# EasyEDA Pro project USB Hub Switch.eprj, board Smart Switch PCB
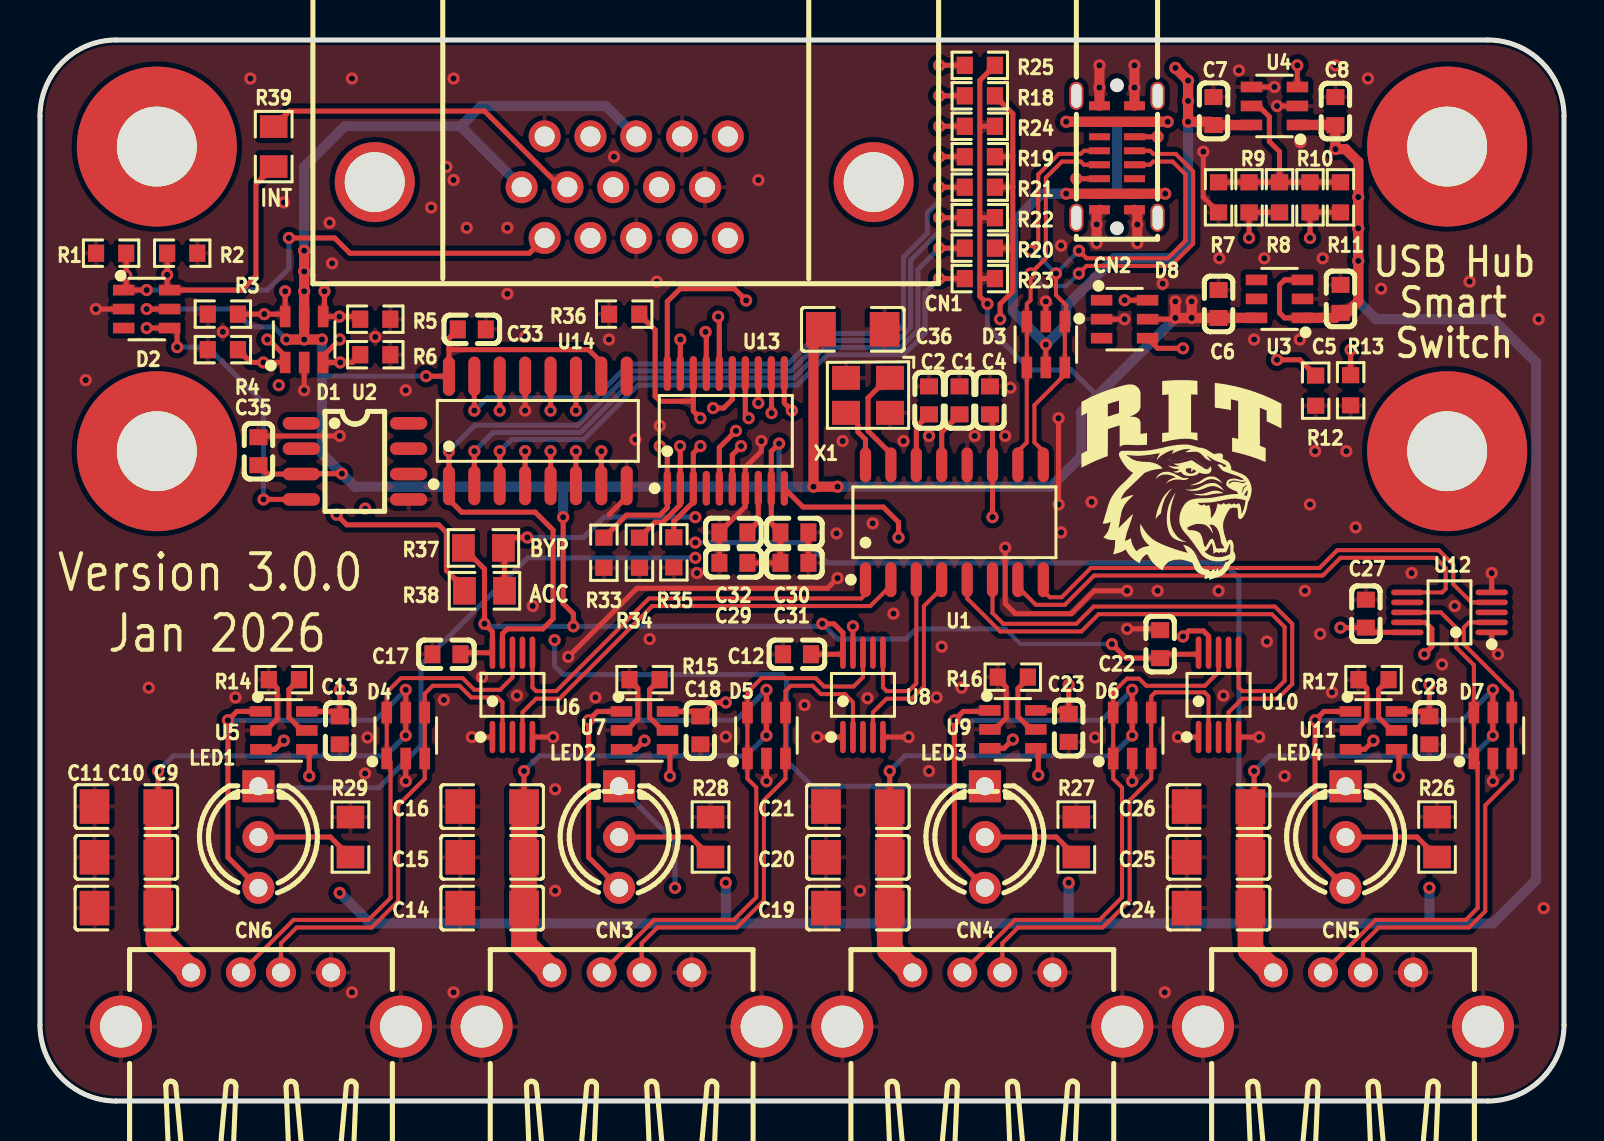
[diagram p4: board, top side]
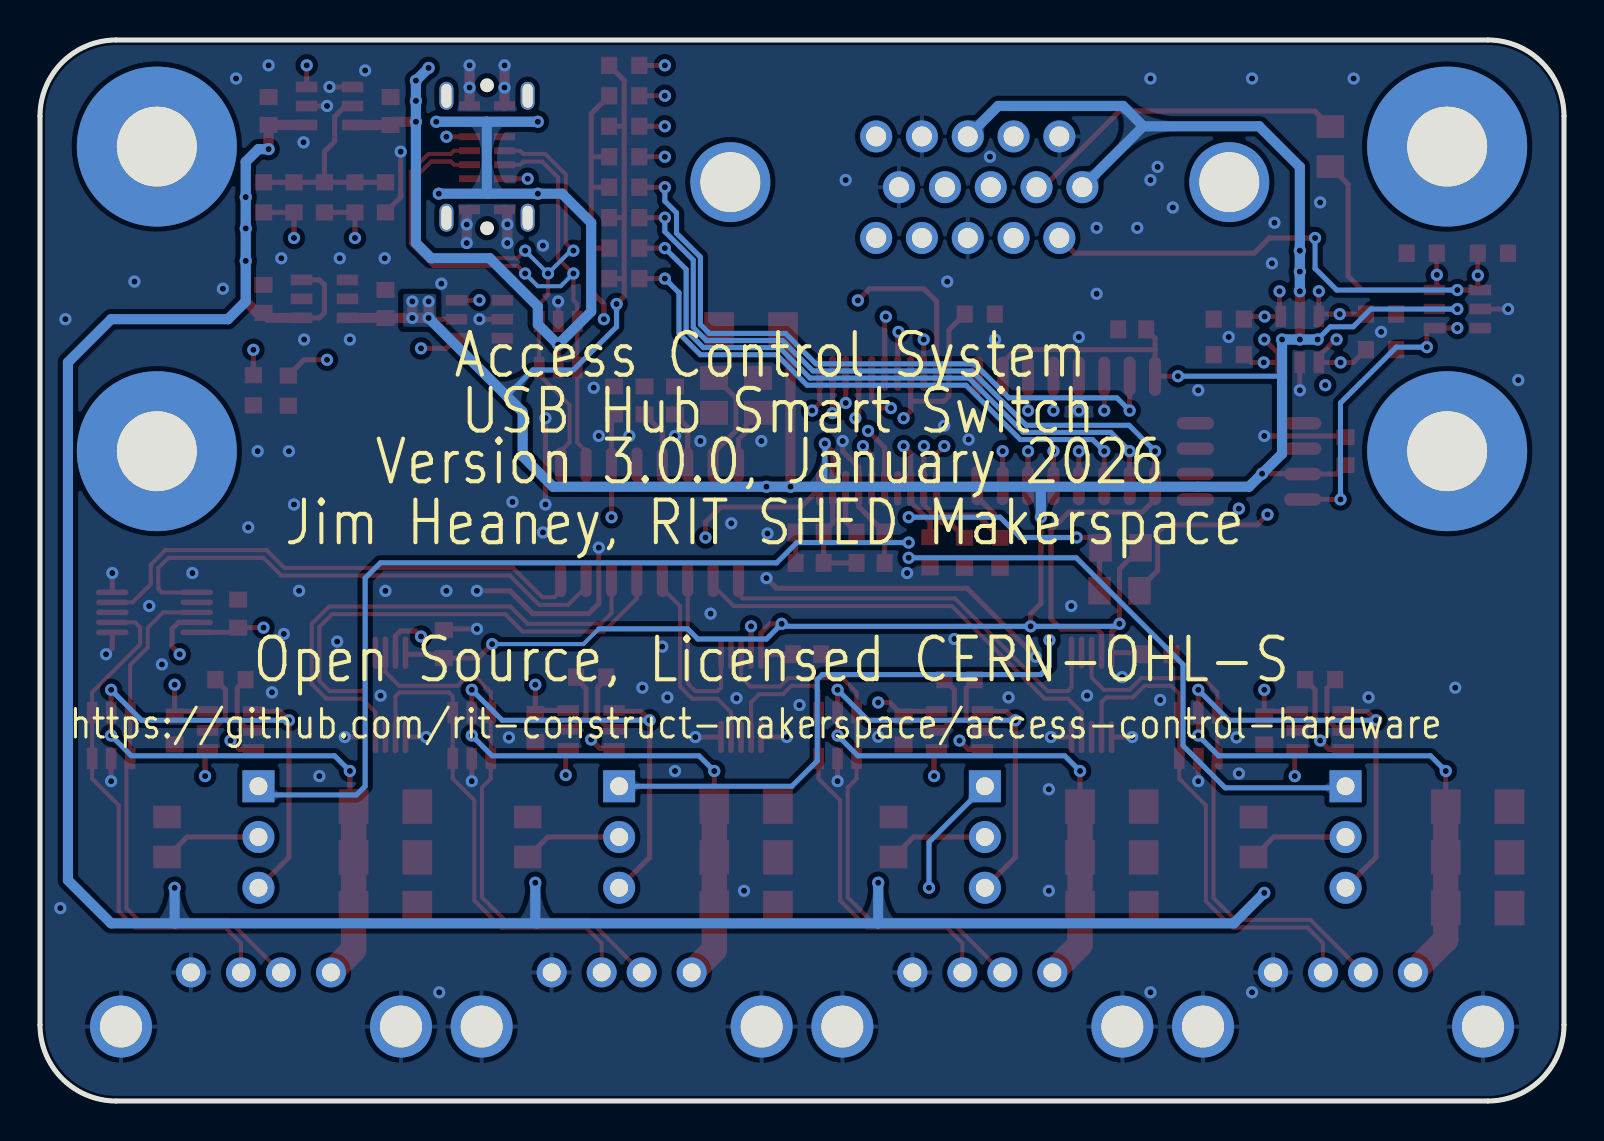
[diagram p5: board, bottom side, seen from below]

Outline 76.2 x 53.09 mm; copper layers: Top Layer, Inner1, Inner2, Bottom Layer. Coordinates in mm from the lower left corner of the outline.
Outline path: 0,49.28 0,3.81 arc(1.12,1.12) 3.81,0 72.39,0 arc(75.08,1.12) 76.2,3.81 76.2,49.28 arc(75.08,51.97) 72.39,53.09 3.81,53.09 arc(1.12,51.97) 0,49.28
Stack: Top Layer 0.035mm Outer layer thickness 1oz / Dielectric1 0.2104mm 7628 RC49% 8.6mil / Inner1 0.0152mm Inner layer thickness / Dielectric2 1.065mm 1.1mm H/HOZ Copper / Inner2 0.0152mm Inner layer thickness / Dielectric3 0.2104mm 7628 RC49% 8.6mil / Bottom Layer 0.035mm Outer layer thickness 1oz

## Design rules (mm)
net D-: DP5
net D+: DP5
net D-1: DP1
net D+1: DP1
net D-2: DP2
net D+2: DP2
net D-3: DP3
net D+3: DP3
net D-4: DP4
net D+4: DP4
net D-HUB4: DP9
net D+HUB4: DP9
net D-HUB3: DP8
net D+HUB3: DP8
net D-HUB2: DP7
net D+HUB2: DP7
net D-HUB1: DP6
net D+HUB1: DP6
template: Custom Config
spacing copperThickness1oz (default): track to track 0.102, other pairs 0.152 to 0.3
spacing copperThickness2oz: track to track 0.203, other pairs 0.152 to 0.3
track width copperThickness1oz (default): min 0.127, default 0.254, max 2.54
track width copperThickness2oz: min 0.203, default 0.254, max 2.54
differential pair USB Coplanar (default): width min 0.203, default 0.203, max 0.203; gap min 0.127, default 0.127
via viaSize (default): diameter min 0.5, default 0.61, max 10; hole min 0.3, default 0.305, max 6.3

## Placement (name value [footprint] x y rotation side)
C1  10uF  [C0603]  45.97 35.05 270 top
C2  10uF  [C0603]  44.45 35.05 270 top
C4  10uF  [C0603]  47.5 35.05 270 top
C5  1uF  [C0603]  65.02 40.13 270 top
C6  10uF  [C0603]  58.93 39.88 270 top
C7  10uF  [C0603]  58.67 49.53 270 top
C8  10uF  [C0603]  64.77 49.53 90 top
C9  47uF  [C1206]  4.32 9.65 180 top
C10  47uF  [C1206]  4.32 12.19 180 top
C11  47uF  [C1206]  4.32 14.73 180 top
C12  100nF  [C0603]  37.85 22.35 0 top
C13  10uF  [C0603]  14.99 18.54 90 top
C14  47uF  [C1206]  22.61 9.65 180 top
C15  47uF  [C1206]  22.61 12.19 180 top
C16  47uF  [C1206]  22.61 14.73 180 top
C17  100nF  [C0603]  20.32 22.35 0 top
C18  10uF  [C0603]  33.02 18.54 90 top
C19  47uF  [C1206]  40.89 9.65 180 top
C20  47uF  [C1206]  40.89 12.19 180 top
C21  47uF  [C1206]  40.89 14.73 180 top
C22  100nF  [C0603]  56.01 22.86 270 top
C23  10uF  [C0603]  51.43 18.67 90 top
C24  47uF  [C1206]  58.93 9.65 180 top
C25  47uF  [C1206]  58.93 12.19 180 top
C26  47uF  [C1206]  58.93 14.73 180 top
C27  100nF  [C0603]  66.29 24.38 270 top
C28  10uF  [C0603]  69.47 18.54 90 top
C29  10uF  [C0603]  34.67 26.92 180 top
C30  1uF  [C0603]  37.72 26.92 180 top
C31  100nF  [C0603]  37.72 28.45 180 top
C32  1uF  [C0603]  34.67 28.45 0 top
C33  100nF  [C0603]  21.59 38.61 180 top
C35  100nF  [C0603]  10.92 32.51 270 top
C36  47uF  [C1206]  40.64 38.61 180 top
CN1  DS1038-15FBNSiA74-0CC  [DSUB-TH_DS1038-15FBNSIA74-0CC]  29.21 45.72 180 top
CN2  HC-TYPE-C-16P-067A  [USB-SMD_HC-TYPE-C-16P-FLS7.2-5A-11]  53.85 47.24 0 top
CN3  902-131A1011D10100  [USB-A-TH__USB-AF-90]  29.08 5.08 0 top
CN4  902-131A1011D10100  [USB-A-TH__USB-AF-90]  47.12 5.08 0 top
CN5  902-131A1011D10100  [USB-A-TH__USB-AF-90]  65.15 5.08 0 top
CN6  902-131A1011D10100  [USB-A-TH__USB-AF-90]  11.05 5.08 0 top
D1  SRV05-4  [SOT-23-6_L2.9-W1.6-P0.95-LS2.8-BL]  13.21 38.1 0 top
D2  SRV05-4  [SOT-23-6_L2.9-W1.6-P0.95-LS2.8-BL]  5.33 39.62 270 top
D3  SRV05-4  [SOT-23-6_L2.9-W1.6-P0.95-LS2.8-BL]  50.29 37.85 180 top
D4  SRV05-4  [SOT-23-6_L2.9-W1.6-P0.95-LS2.8-BL]  18.29 18.29 0 top
D5  SRV05-4  [SOT-23-6_L2.9-W1.6-P0.95-LS2.8-BL]  36.32 18.29 0 top
D6  SRV05-4  [SOT-23-6_L2.9-W1.6-P0.95-LS2.8-BL]  54.61 18.29 0 top
D7  SRV05-4  [SOT-23-6_L2.9-W1.6-P0.95-LS2.8-BL]  72.64 18.29 0 top
D8  SRV05-4  [SOT-23-6_L2.9-W1.6-P0.95-LS2.8-BL]  54.23 39.12 270 top
LED1  TZ-LAMP05RB4HD-C  [LED-TH_3P-BD5.8-P2.54-R-BI]  10.92 13.21 90 top
LED2  TZ-LAMP05RB4HD-C  [LED-TH_3P-BD5.8-P2.54-R-BI]  28.96 13.21 90 top
LED3  TZ-LAMP05RB4HD-C  [LED-TH_3P-BD5.8-P2.54-R-BI]  47.24 13.21 90 top
LED4  TZ-LAMP05RB4HD-C  [LED-TH_3P-BD5.8-P2.54-R-BI]  65.28 13.21 90 top
NOREF  -  [Pad_e1726]  5.84 47.75 0 top
NOREF#2  -  [Pad_e1666]  70.36 32.51 0 top
NOREF#3  -  [Pad_e1727]  70.36 47.75 0 top
NOREF#4  -  [Pad_e1686]  5.84 32.51 0 top
R1  10kΩ  [R0603]  3.56 42.42 180 top
R2  120kΩ  [R0603]  7.11 42.42 180 top
R3  10kΩ  [R0603]  9.14 39.37 0 top
R4  10kΩ  [R0603]  9.14 37.59 0 top
R5  10kΩ  [R0603]  16.76 39.12 180 top
R6  10kΩ  [R0603]  16.76 37.34 180 top
R7  120kΩ  [R0603]  58.93 45.21 90 top
R8  120kΩ  [R0603]  61.98 45.21 90 top
R9  120kΩ  [R0603]  60.45 45.21 90 top
R10  120kΩ  [R0603]  63.5 45.21 90 top
R11  120kΩ  [R0603]  65.02 45.21 90 top
R12  5.1kΩ  [R0603]  63.78 35.54 90 top
R13  5.1kΩ  [R0603]  65.53 35.56 90 top
R14  120kΩ  [R0603]  12.19 21.08 0 top
R15  120kΩ  [R0603]  30.23 21.08 0 top
R16  120kΩ  [R0603]  48.64 21.21 0 top
R17  120kΩ  [R0603]  66.67 21.08 0 top
R18  10kΩ  [R0603]  46.99 50.29 180 top
R19  10kΩ  [R0603]  46.99 47.24 180 top
R20  10kΩ  [R0603]  46.99 42.67 180 top
R21  10kΩ  [R0603]  46.99 45.72 180 top
R22  10kΩ  [R0603]  46.99 44.2 180 top
R23  10kΩ  [R0603]  46.99 41.15 180 top
R24  10kΩ  [R0603]  46.99 48.77 180 top
R25  10kΩ  [R0603]  46.99 51.82 180 top
R26  1kΩ  [R0805]  69.85 13.21 270 top
R27  1kΩ  [R0805]  51.82 13.21 270 top
R28  1kΩ  [R0805]  33.53 13.21 270 top
R29  1kΩ  [R0805]  15.52 13.21 270 top
R33  10kΩ  [R0603]  28.19 27.43 270 top
R34  10kΩ  [R0603]  29.97 27.43 270 top
R35  10kΩ  [R0603]  31.69 27.45 270 top
R36  10kΩ  [R0603]  29.21 39.37 180 top
R37  0Ω  [R0805]  22.17 27.67 0 top
R38  0Ω  [R0805]  22.23 25.53 0 top
R39  0Ω  [R0805]  11.68 47.75 90 top
U1  SL2.1A  [SOP-16_L10.0-W3.9-P1.27-LS6.0-BL]  45.72 28.96 0 top
U2  DS18B20Z  [SOP-8_L4.9-W3.9-P1.27-LS6.0-BL]  15.75 32 270 top
U3  MX66100T  [SOT-23-6_L2.9-W1.6-P0.95-LS2.9-BL]  61.98 40.13 90 top
U4  CH217K  [SOT-23-6_L2.9-W1.6-P0.95-LS2.8-BL]  61.72 49.78 90 top
U5  CH217K  [SOT-23-6_L2.9-W1.6-P0.95-LS2.8-BL]  12.19 18.54 270 top
U6  DIO32220MP10  [MSOP-10_L3.0-W3.0-P0.50-LS5.0-BL]  23.62 20.32 0 top
U7  CH217K  [SOT-23-6_L2.9-W1.6-P0.95-LS2.8-BL]  30.23 18.54 270 top
U8  DIO32220MP10  [MSOP-10_L3.0-W3.0-P0.50-LS5.0-BL]  41.15 20.32 0 top
U9  CH217K  [SOT-23-6_L2.9-W1.6-P0.95-LS2.8-BL]  48.64 18.59 270 top
U10  DIO32220MP10  [MSOP-10_L3.0-W3.0-P0.50-LS5.0-BL]  58.93 20.32 0 top
U11  CH217K  [SOT-23-6_L2.9-W1.6-P0.95-LS2.8-BL]  66.67 18.54 270 top
U12  DIO32220MP10  [MSOP-10_L3.0-W3.0-P0.50-LS5.0-BL]  70.47 24.45 90 top
U13  STM8S003F3P6TR  [TSSOP-20_L6.5-W4.4-P0.65-LS6.4-BL]  34.29 33.53 0 top
U14  74HC595D,118  [SOIC-16_L9.9-W3.9-P1.27-LS6.0-BL]  24.89 33.53 0 top
X1  12MHz  [OSC-SMD_4P-L3.2-W2.5-BL]  41.4 35.31 180 top

## Footprints (pads in the part's own frame, mm; a bottom-side part is the same pattern mirrored in y, then rotated)
C0603
  rect 0.8x0.9 smd: 1(-0.7,0) 2(0.7,0)
C1206
  rect 1.485x1.728 smd: 1(-1.593,0) 2(1.593,0)
DSUB-TH_DS1038-15FBNSIA74-0CC
  round 1.6 hole 1: 1(3.978,2.54) 2(1.688,2.54) 3(-0.603,2.54) 4(-2.893,2.54) 5(-5.182,2.54) 6(5.128,0) 7(2.837,0) 8(0.548,0) 9(-1.743,0) 10(-4.042,0) 11(3.978,-2.54) 12(1.688,-2.54) 13(-0.603,-2.54) 14(-2.893,-2.54) 15(-5.182,-2.54)
  round 4 hole 3: 16(12.473,-0.254) 17(-12.473,-0.254)
LED-TH_3P-BD5.8-P2.54-R-BI
  rect 1.6x1.6 hole 0.9: 1(2.54,0)
  round 1.6 hole 0.9: 2(0,0) 3(-2.54,0)
MSOP-10_L3.0-W3.0-P0.50-LS5.0-BL
  oval 0.28x1.62 smd: 1(-1,-2.11) 2(-0.5,-2.11) 3(0,-2.11) 4(0.5,-2.11) 5(1,-2.11) 6(1,2.11) 7(0.5,2.11) 8(0,2.11) 9(-0.5,2.11) 10(-1,2.11)
OSC-SMD_4P-L3.2-W2.5-BL
  rect 1.4x1.2 smd: 1(-1.1,-0.875) 2(1.1,-0.875) 3(1.1,0.875) 4(-1.1,0.875)
Pad_e1666
  round 8 hole 4: 1(0,0)
Pad_e1686
  round 8 hole 4: 1(0,0)
Pad_e1726
  round 8 hole 4: 1(0,0)
Pad_e1727
  round 8 hole 4: 1(0,0)
R0603
  rect 0.806x0.864 smd: 1(-0.753,0) 2(0.753,0)
R0805
  rect 1.133x1.377 smd: 1(-1,0) 2(1,0)
SOIC-16_L9.9-W3.9-P1.27-LS6.0-BL
  oval 0.602x1.971 smd: 1(-4.445,-2.736) 2(-3.175,-2.736) 3(-1.905,-2.736) 4(-0.635,-2.736) 5(0.635,-2.736) 6(1.905,-2.736) 7(3.175,-2.736) 8(4.445,-2.736) 9(4.445,2.736) 10(3.175,2.736) 11(1.905,2.736) 12(0.635,2.736) 13(-0.635,2.736) 14(-1.905,2.736) 15(-3.175,2.736) 16(-4.445,2.736)
SOP-8_L4.9-W3.9-P1.27-LS6.0-BL
  oval 0.63x1.865 smd: 1(-1.905,-2.683) 2(-0.635,-2.683) 3(0.635,-2.683) 4(1.905,-2.683) 5(1.905,2.683) 6(0.635,2.683) 7(-0.635,2.683) 8(-1.905,2.683)
SOP-16_L10.0-W3.9-P1.27-LS6.0-BL
  oval 0.56x1.745 smd: 1(-4.445,-2.873) 2(-3.175,-2.873) 3(-1.905,-2.873) 4(-0.635,-2.873) 5(0.635,-2.873) 6(1.905,-2.873) 7(3.175,-2.873) 8(4.445,-2.873) 9(4.445,2.873) 10(3.175,2.873) 11(1.905,2.873) 12(0.635,2.873) 13(-0.635,2.873) 14(-1.905,2.873) 15(-3.175,2.873) 16(-4.445,2.873)
SOT-23-6_L2.9-W1.6-P0.95-LS2.8-BL
  rect 0.532x1.072 smd: 1(-0.95,-1.149) 2(0,-1.149) 3(0.95,-1.149) 4(0.95,1.149) 5(0,1.149) 6(-0.95,1.149)
SOT-23-6_L2.9-W1.6-P0.95-LS2.9-BL
  rect 0.532x1.072 smd: 1(-0.95,-1.149) 2(0,-1.149) 3(0.95,-1.149) 4(0.95,1.149) 5(0,1.149) 6(-0.95,1.149)
TSSOP-20_L6.5-W4.4-P0.65-LS6.4-BL
  oval 0.364x1.742 smd: 1(-2.925,-2.871) 2(-2.275,-2.871) 3(-1.625,-2.871) 4(-0.975,-2.871) 5(-0.325,-2.871) 6(0.325,-2.871) 7(0.975,-2.871) 8(1.625,-2.871) 9(2.275,-2.871) 10(2.925,-2.871) 11(2.925,2.871) 12(2.275,2.871) 13(1.625,2.871) 14(0.975,2.871) 15(0.325,2.871) 16(-0.325,2.871) 17(-0.975,2.871) 18(-1.625,2.871) 19(-2.275,2.871) 20(-2.925,2.871)
USB-A-TH__USB-AF-90
  round 1.5 hole 0.9: 1(-3.5,1.355) 2(-1,1.355) 3(1,1.355) 4(3.5,1.355)
  round 3.1 hole 2.1: SH1(7,-1.355) SH2(-7,-1.355)
USB-SMD_HC-TYPE-C-16P-FLS7.2-5A-11
  oval 0.7x1.4 hole 0.5x1.2: 0(-2.03,3.05) 0(-2.03,-3.05) 0(2.03,3.05) 0(2.03,-3.05)
  rect 1.05x0.45 smd: A1(-0.875,-2.65) A4(-0.875,-1.85) A9(-0.875,1.75) A12(-0.875,2.55) B1(0.875,2.55) B4(0.875,1.75) B9(0.875,-1.85) B12(0.875,-2.65)
  rect 1.05x0.35 smd: A5(-0.875,-1.1) A6(-0.875,-0.4) A7(-0.875,0.3) A8(-0.875,1) B5(0.875,1) B6(0.875,0.3) B7(0.875,-0.4) B8(0.875,-1.1)

## Nets
As in the schematic.

Pads without a net: CN1 4 5 16 17; CN2 0 A8 B8; D2 3; D8 1 3; NOREF 1; NOREF#2 1; NOREF#3 1; NOREF#4 1; U2 1 2 6 7 8; U3 4 5; U6 3 7; U8 3 7; U10 3 7; U12 3 7; U13 4; U14 9

## Via types
v1: diameter 0.61, hole 0.305, Top Layer to Bottom Layer, 272 vias

## Routing (per net, layer and track width the routed paths; a pad name or vN(x,y) marks a point on that pad's centre or on a via; arc(x,y) is an arc through that point)
+5V: length 242.4
  Top Layer w0.254: v1(19.3,36.26) 20.45,36.26 20.45,37.59 ; 46.99,41.17 47.01,41.15 R23.1 ; 46.99,41.17 46.99,44.18 ; 46.99,41.17 46.99,40.26 v1(47.37,39.88) ; 46.99,48.78 46.99,51.06 R25.1 ; 46.99,48.78 46.99,44.18 ; 46.99,48.78 47,48.77 R24.1 ; D8.5 56.71,39.12 v1(56.77,39.18) ; D2.5 v1(5.33,39.62) ; 46.99,44.18 47,44.2 R22.1 ; C33.2 20.45,38.17 20.45,37.59 ; U12.10 66.53,23.45 C27.2 v1(65.02,23.68) ; 20.45,37.59 27.43,37.59 28.07,36.96 28.07,36.26 ; C12.2 40.07,22.35 U8.10 40.15,23.42 39.7,23.88 v1(39.12,23.88) ; C22.2 54.29,22.16 v1(53.59,22.86) ; 56.33,22.35 57.85,22.35 U10.10 ; C35.2 11.36,31.37 U2.3 13.08,31.39 v1(15.1,31.39) ; C17.2 21.1,22.43 U6.10 22.62,23.48 v1(22.23,23.88) 22.23,26.62 R37.1 ; v1(26.16,29.21) 26.16,24.9 26.15,24.89 26.67,24.38 v1(26.67,23.75) ; v1(36.96,32.89) 36.57,32.5 U13.9 36.57,28.9 37.02,28.45 37.02,26.92 C29.1
  Top Layer w0.508: v1(13.21,38.1) v1(12.32,38.1) ; v1(13.21,38.1) D1.5 v1(13.21,40.51) v1(13.21,41.5) v1(13.21,42.55) ; v1(13.21,38.1) v1(14.1,38.1) ; 38.79,39.12 38.67,39 v1(38.67,30.73) v1(39.88,30.73) ; v1(56.77,40.01) v1(56.77,39.18) v1(57.58,39.18) ; 59.18,39.18 U3.6 ; v1(57.58,39.18) v1(57.58,40.01) ; v1(57.58,39.18) C6.2
  Inner2 w0.254: v1(65.02,23.68) 65.02,22.86 64.26,22.1 54.36,22.1 v1(53.59,22.86)
  Bottom Layer w0.203: v1(53.59,22.86) 49.03,22.86 48.26,23.62
  Bottom Layer w0.254: 36.98,30.73 36.96,30.75 v1(36.96,32.89) ; v1(47.37,39.88) 47.37,38.74 49.53,36.58 51.56,36.58 52.86,35.27 ; 48.26,23.62 43.82,23.62 43.31,23.11 39.88,23.11 v1(39.12,23.88) 38.99,23.75 v1(26.67,23.75) 22.35,23.75 v1(22.23,23.88) ; 14.1,36.21 14.15,36.26 v1(19.3,36.26) ; v1(5.33,39.62) 9.65,39.62 10.54,38.74 11.68,38.74 v1(12.32,38.1) ; 18.29,30.73 18.3,30.73
  Bottom Layer w0.508: v1(13.21,40.51) v1(13.21,41.5) v1(13.21,42.55) 13.21,46.74 15.24,48.77 21.03,48.77 ; 21.03,48.77 22.05,49.78 28.29,49.78 CN1.13 ; 21.03,48.77 CN1.6 ; v1(56.77,39.18) 52.07,34.48 52.07,32.26 50.55,30.73 v1(39.88,30.73) v1(38.67,30.73) 26.16,30.73 ; 26.16,30.73 15.75,30.73 v1(15.1,31.39) 14.1,32.39 v1(14.1,38.1) v1(13.21,38.1) v1(12.32,38.1) ; 26.16,30.73 v1(26.16,29.21)
GND: length 90.5
  Top Layer w0.254: D3.2 v1(50.29,40.01) ; 65.77,18.54 66.34,19.11 66.34,20.65 65.91,21.08 ; C22.1 55.95,23.62 v1(54.36,23.62) ; U6.5 v1(25.65,18.21) ; U4.4 v1(61.72,50.73) ; U14.8 29.34,30.23 28.45,29.34 ; v1(58.17,47.5) 58.17,45.22 R7.1 ; 47.74,18.59 48.31,19.16 48.31,20.71 47.88,21.13 ; U4.2 v1(61.85,49.78) ; D7.2 v1(72.64,16) ; D6.2 v1(54.61,16) ; C31.1 C30.1 ; v1(54.36,25.53) 52.7,25.53 51.56,24.38 48.77,24.38 48.26,24.89 v1(48.26,27.69) ; 29.32,18.54 29.89,19.11 29.89,20.65 29.46,21.08 ; 33.97,26.92 33.97,28.45 35.27,29.74 U13.7 35.27,31.71 36.07,32.51 v1(36.07,33.02) ; D8.2 v1(54.23,39.12) ; v1(26.42,22.23) 29.85,25.65 39.37,25.65 v1(39.88,26.16) ; D4.2 v1(18.29,16) ; v1(50.93,34.16) v1(50.93,29.85) ; D2.2 v1(2.79,39.62) ; U10.5 v1(60.96,18.21) ; U12.1 72.58,22.67 v1(72.9,22.35) ; U14.13 v1(24.26,34.54) ; 11.18,21.08 11.43,21.08 11.86,20.65 11.86,19.11 11.29,18.54 U5.2 ; U6.1 v1(21.59,18.21) ; U12.5 v1(72.58,26.42) ; U8.5 v1(43.43,18.21) ; U10.1 v1(56.9,18.21) ; D5.2 v1(36.32,16) ; U8.1 v1(38.86,18.21) ; v1(14.99,33.27) 10.98,33.27 C35.1 ; D1.2 v1(13.21,35.56)
  Top Layer w0.508: CN2.A12 v1(52.97,50.71) v1(52.97,51.82) ; v1(54.86,42.93) v1(54.86,43.85) 54.86,44.45 CN2.B12 ; CN2.A1 52.83,44.45 v1(52.83,43.86) v1(52.83,42.93) ; v1(54.72,51.82) v1(54.72,50.71) CN2.B1
  vias: v1(2.29,36.07) v1(5.44,20.68) v1(9.14,38.48) v1(9.77,20.19) v1(10.52,51.16) v1(12.19,44.96) v1(14.48,43.94) v1(14.61,41.91) v1(15.6,51.16) v1(15.6,5.44) v1(16.26,16.38) v1(16.38,18.19) v1(16.76,38.23) v1(18.29,35.56) v1(19.56,44.7) v1(20.19,20.07) v1(20.32,46.74) v1(20.68,51.16) v1(20.68,46.08) v1(20.68,5.44) v1(21.34,43.69) v1(22.1,21.21) v1(23.37,43.69) v1(23.37,40.39) v1(23.85,20.28) v1(24.26,38.23) v1(24.64,24.77) v1(25.76,15.6) v1(25.76,10.52) v1(27.77,20.19) v1(28.45,38.1) v1(28.7,47.24) v1(29.77,33.1) v1(30.48,23.11) v1(30.84,41) v1(30.99,33.78) v1(32.85,26.42) v1(34.29,18.23) v1(35.92,46.08) v1(38.23,19.81) v1(39.83,28.4) v1(40.13,33.02) v1(41,10.52) v1(41.37,20.16) v1(41.64,28.9) v1(42.67,24.38) v1(43.18,33.02) v1(44.45,33.27) v1(44.45,16.51) v1(44.83,20.19) v1(45.08,22.73) v1(46.08,20.68) v1(46.74,33.27) v1(48.26,33.27) v1(48.51,35.69) v1(51.05,42.8) v1(51.05,28.45) v1(52.58,29.97) v1(52.75,18.19) v1(55.88,25.53) v1(56.13,40.89) v1(56.24,5.44) v1(58.96,42.16) v1(58.93,25.53) v1(59.17,20.28) v1(59.94,51.56) v1(60.71,38.1) v1(61.21,42.16) v1(61.34,22.99) v1(62.23,16.26) v1(63.02,47.97) v1(62.99,38.1) v1(63.25,25.53) v1(63.5,29.85) v1(63.75,32.51) v1(64.01,23.37) v1(64.14,42.16) v1(64.6,20.45) v1(64.77,51.82) v1(65.32,32.51) v1(65.79,28.7) v1(66.4,51.16) v1(67.06,40.64) v1(68.58,26.42) v1(70.1,21.84) v1(70.74,24.77) v1(71.48,41) v1(74.93,39.12) v1(75.18,9.65)
VIN: length 223.5
  Top Layer w0.254: v1(69.47,20.83) C28.2 69.22,19.49 U11.6 ; R18.1 48.64,49.39 48.64,47.27 ; v1(14.99,20.57) C13.2 14.74,19.49 U5.6 ; 48.64,47.27 48.62,47.24 R19.1 ; 48.64,47.27 48.64,45.74 ; v1(48.01,39.12) 48.01,39.88 48.64,40.51 48.64,42.63 ; U7.6 32.77,19.49 C18.2 33.72,19.94 v1(34.29,19.94) ; 48.64,45.74 48.64,42.63 ; 48.64,45.74 48.62,45.72 R21.1 ; v1(47.62,29.21) U1.11 47.62,34.23 C4.2 ; R20.1 48.6,42.67 48.64,42.63 ; U9.6 51.26,19.54 C23.2 v1(51.43,20.83) ; U3.1 62.23,39.18 61.98,39.44 61.98,40.83 62.23,41.08 U3.3
  Top Layer w0.508: U4.1 64.77,48.83 C8.1 v1(64.77,47.62) 65.28,47.62 65.91,46.99 v1(65.91,45.23) v1(65.91,43.66) v1(65.91,42.03) 65.91,40.01 65.34,39.43 C5.2 64.77,39.18 U3.1
  Inner1 w0.254: v1(48.01,39.12) 47.62,38.74 v1(47.62,29.21)
  Inner2 w0.762: v1(34.29,10.92) 33.27,11.94 33.27,18.92 v1(34.29,19.94) ; v1(51.43,10.92) v1(51.43,20.83) 51.43,26.42 48.64,29.21 v1(47.62,29.21) ; v1(14.99,20.57) v1(14.99,10.41) ; v1(69.47,20.83) v1(69.47,10.67)
  Bottom Layer w0.508: 69.47,8.89 51.35,8.89 ; 69.47,8.89 v1(69.47,10.67) ; 69.47,8.89 72.64,8.89 74.8,11.05 74.8,36.96 72.64,39.12 66.8,39.12 65.91,40.01 v1(65.91,42.03) v1(65.91,43.66) v1(65.91,45.23) 65.91,46.99 65.28,47.62 v1(64.77,47.62) ; 51.35,8.89 51.43,8.98 v1(51.43,10.92) ; 51.35,8.89 34.29,8.89 ; v1(34.29,10.92) 34.29,8.89 34.29,8.89 ; 34.29,8.89 16.51,8.89 v1(14.99,10.41)
1.5A-SET: length 45.2
  Top Layer w0.254: U13.12 36.58,36.39 v1(36.58,34.42) ; v1(60.45,43.18) R9.1 R8.1
  Inner2 w0.254: v1(60.45,43.18) 60.45,41.78 63.88,38.35 65.79,38.35 66.17,37.97 66.17,37.21 64.62,35.66 50.91,35.66 50.14,34.9 38.12,34.9 37.85,35.18 37.4,35.18 36.64,34.42 v1(36.58,34.42)
3A-SET: length 43.3
  Top Layer w0.254: R11.1 R10.1 v1(63.5,43.18) ; v1(37.59,34.54) 37.21,34.92 37.21,36.4
  Inner2 w0.254: v1(37.59,34.54) 50.29,34.54 51.05,35.31 64.77,35.31 66.52,37.06 66.52,38.12 65.93,38.71 64.03,38.71 63.5,39.24 v1(63.5,43.18)
595-CLK: length 15.6
  Top Layer w0.254: U13.15 34.61,35.1 34.18,34.67 v1(33.65,34.67) ; U14.12 v1(25.53,34.54)
  Inner2 w0.254: v1(25.53,34.54) 26.42,33.66 27.81,33.66 29.36,32.11 33.27,32.11 33.65,32.49 v1(33.65,34.67)
595-DATA: length 19.6
  Top Layer w0.254: U13.16 33.96,39.19 v1(33.91,39.24) ; U14.14 v1(22.99,34.54)
  Inner1 w0.254: v1(22.99,34.54) 22.99,38.23 23.49,38.74 23.94,38.74 24.45,39.24 v1(33.91,39.24)
595-STORE: length 14.1
  Top Layer w0.254: v1(26.8,34.54) U14.11 ; U13.17 33.32,38.44 v1(33.27,38.48)
  Inner1 w0.254: v1(26.8,34.54) 26.8,37.72 27.96,38.89 32.87,38.89 v1(33.27,38.48)
ACCESS: length 53.7
  Top Layer w0.254: R38.1 21.23,25.64 20.32,26.54 20.32,28.45 19.94,28.83 15.33,28.83 v1(14.83,29.34) ; R1.1 v1(4.31,41.31) 4.31,40.7 D2.1 v1(5.33,40.57) ; v1(12.45,43.18) 14.73,43.18 15.49,42.42 24.47,42.42 CN1.1
  Inner2 w0.254: v1(4.31,41.31) 4.31,37.6 4.83,37.08 7.62,37.08 10.41,34.29 10.41,32 11.68,30.73 13.43,30.73 v1(14.83,29.34)
  Bottom Layer w0.254: v1(12.45,43.18) 12.45,41.66 11.36,40.57 v1(5.33,40.57)
ACCESS-READ: length 21.4
  Top Layer w0.254: R38.2 23.23,27.62 R37.2 23.17,27.87 23.49,28.19 v1(24.37,28.19) ; U13.13 v1(35.92,34.93)
  Inner1 w0.254: v1(35.92,34.93) 35.18,34.93 34.01,33.76 34.01,30.46 v1(32.77,29.21)
  Bottom Layer w0.254: v1(24.37,28.19) 27.18,28.19 28.19,29.21 v1(32.77,29.21)
BUSIO1: length 63.9
  Top Layer w0.254: 32.67,35.01 31.01,35.01 30.76,35.27 30.76,38.58 R36.1 ; 32.67,35.01 U13.18 ; 32.67,35.01 32.67,34.52 v1(33.02,34.16) ; v1(12.26,40.51) D1.6 12.14,39.37 v1(11.21,39.37) R3.2
  Inner1 w0.254: v1(11.94,35.81) 12.95,34.8 15.5,34.8 19.44,30.86 32.39,30.86 33.65,32.12 33.65,33.53 v1(33.02,34.16)
  Inner2 w0.254: v1(12.26,40.51) 12.89,39.88 16.26,39.88 17.68,41.3 20.47,41.3 21.08,41.91 25.65,41.91 26.31,42.57 26.31,43.84 26.92,44.45 27.69,44.45 28.66,45.43 CN1.8 ; v1(11.94,35.81) 11.43,35.81 10.41,36.83 10.41,38.57 v1(11.21,39.37)
BUSIO2: length 60.9
  Top Layer w0.254: v1(11.37,38.1) 11.43,38.1 12.26,37.27 D1.1 v1(11.17,36.95) 10.54,36.95 R4.2 ; R35.1 31.69,28.99 32.67,29.97 U13.3 32.67,32.41 v1(33.02,32.77)
  Inner1 w0.254: 14.49,36.32 14.48,36.32 13.85,36.95 v1(11.17,36.95) ; v1(33.02,32.77) 33.02,31.99 32.25,31.22 19.58,31.22 14.48,36.32
  Inner2 w0.254: CN1.9 30.95,42.13 30.02,41.2 21.37,41.2 16.5,36.32 13.15,36.32 v1(11.37,38.1)
BUSIO3: length 49.5
  Top Layer w0.254: R5.2 15.88,39.25 v1(14.97,39.25) D1.4 14.22,39.32 v1(14.22,40.51) ; v1(30.99,32.77) 31.36,32.39 U13.1 31.36,29.69 30.99,29.31 29.32,29.31 R33.1
  Inner1 w0.254: v1(14.97,39.25) 16.89,39.25 17.53,38.61 17.53,34.29 19.89,31.93 30.15,31.93 v1(30.99,32.77)
  Inner2 w0.254: CN1.12 27.18,48.26 25.27,46.36 25.27,44.96 24.64,44.32 22.99,44.32 20.32,41.66 17.53,41.66 16.39,40.51 v1(14.22,40.51)
BUSIO4: length 55
  Top Layer w0.254: R6.2 15.62,36.95 v1(15.01,36.95) D1.3 14.22,37.02 14.22,37.34 v1(14.99,38.1) ; R34.1 30.74,28.96 31.14,28.96 32.02,29.83 U13.2 32.02,32.76 v1(32,32.77)
  Inner1 w0.254: v1(32,32.77) 32,32 31.57,31.57 19.73,31.57 15.01,36.29 v1(15.01,36.95)
  Inner2 w0.254: v1(14.99,38.1) 17.83,40.94 20.61,40.94 21.23,41.55 27.84,41.55 28.7,42.42 28.7,43.94 29.85,45.09 29.85,46.36 30.48,46.99 33.12,46.99 CN1.15
CC1: length 67.9
  Top Layer w0.254: U13.20 31.36,40 32,40.64 34.72,40.64 v1(35.31,40.06) ; R13.2 v1(65.53,37.58) ; v1(57.15,37.66) 55.89,37.66 D8.4 ; CN2.A5 v1(51.82,46.14)
  Inner1 w0.254: v1(57.15,37.66) 57.49,38 59.03,38 60.53,36.5 64.45,36.5 v1(65.53,37.58)
  Inner2 w0.254: v1(51.82,46.14) 56.47,46.14 57.02,45.59 57.02,41.79 58.83,39.98 58.83,37.7 60.02,36.5 64.45,36.5 v1(65.53,37.58) ; v1(35.31,40.06) 35.79,40.54 40.49,40.54 42.91,38.12 48.74,38.12 49.78,37.08 50.8,37.08 51.84,38.12 56.68,38.12 v1(57.15,37.66)
CC2: length 55.5
  Top Layer w0.254: R12.2 62.99,37.08 v1(61.85,37.08) ; U13.19 v1(32.02,38.1) ; CN2.B5 v1(55.88,48.24) ; D8.6 v1(54.23,40.07)
  Inner1 w0.254: v1(54.23,40.07) 55.94,38.35 59.18,38.35 60.45,37.08 v1(61.85,37.08)
  Inner2 w0.254: v1(55.88,48.24) 57.38,46.75 57.38,41.94 59.18,40.13 59.18,37.85 59.94,37.08 v1(61.85,37.08) ; v1(32.02,38.1) 32.02,39.13 33.78,40.89 40.64,40.89 43.05,38.48 52.64,38.48 v1(54.23,40.07)
D+: length 34.3
  Top Layer w0.203: v1(51.94,41.4) 52.32,41.78 56.55,41.78 57.66,42.9 57.66,46.51 56.79,47.38 55.66,47.38 55.5,47.54 CN2.B6 ; CN2.A6 52.19,46.84 52.03,47 51.1,47 50.29,46.2 50.29,42.16 v1(49.53,41.4) 49.53,40.07 49.34,39.88 D3.3 D3.4 49.34,36.69 49.34,32.95 48.89,32.51 48.89,31.83
  Bottom Layer w0.203: v1(49.53,41.4) 50.17,40.77 51.31,40.77 v1(51.94,41.4)
D+1: length 25.2
  Top Layer w0.203: U6.2 23.12,19.95 22.88,20.19 21.56,20.19 20.98,20.78 19.64,20.78 19.24,20.38 D4.4 D4.3 19.24,16.13 17.91,14.8 17.91,10 16.59,8.68 12.83,8.68 12.05,7.9 CN6.3
D+2: length 24.9
  Top Layer w0.203: CN3.3 30.08,7.9 30.87,8.68 34.84,8.68 36.2,10.03 36.2,15.05 37.27,16.13 D5.3 D5.4 37.27,20.51 37.54,20.78 38.63,20.78 39.05,20.36 40.24,20.36 40.65,19.95 U8.2
D+3: length 24.4
  Top Layer w0.203: CN4.3 48.12,7.9 48.9,8.68 53.13,8.68 54.48,10.03 54.48,15.05 55.56,16.13 D6.3 D6.4 55.56,20.24 55.76,20.45 58.23,20.45 58.43,20.24 U10.2
D+4: length 25.5
  Top Layer w0.203: U12.2 71.45,23.95 71.19,23.69 71.19,22.85 73.59,20.45 D7.4 D7.3 73.59,16.13 72.26,14.8 72.26,9.49 71.45,8.68 66.94,8.68 66.15,7.9 CN5.3
D+HUB1: length 22.6
  Top Layer w0.203: U6.4 24.12,19.45 24.8,20.13 25.97,20.13 30.61,24.77 41.51,24.77 42.55,25.8 U1.2
D+HUB2: length 10
  Top Layer w0.203: U1.4 45.08,25.65 44.2,24.77 44.2,20.73 43.59,20.13 42.33,20.13 41.65,19.45 U8.4
D+HUB3: length 25.6
  Top Layer w0.203: U10.4 59.43,19.45 60.11,20.13 61.88,20.13 62.61,20.86 62.61,23.88 61.75,24.74 52.68,24.74 51.82,23.88 48.16,23.88 47.62,24.42 U1.6
D+HUB4: length 25.7
  Top Layer w0.203: U12.4 71.57,24.95 70.67,25.86 70.67,26.83 69.93,27.56 64.87,27.56 63.98,26.67 52.55,26.67 51.08,25.21 50.49,25.21 50.17,25.53 U1.8
D-: length 33.6
  Top Layer w0.203: CN2.A7 52.19,47.54 52.03,47.38 50.94,47.38 49.91,46.36 49.91,42.93 v1(49.53,42.55) ; CN2.B7 55.5,46.84 55.66,47 56.63,47 57.28,46.36 57.28,43.05 56.39,42.16 52.32,42.16 v1(51.94,42.55) ; U1.9 50.17,32.51 49.72,32.96 49.72,34.82 51.24,36.34 D3.6 D3.1 51.31,39.06 51.31,39.82 50.8,40.32 v1(50.8,41.4)
  Bottom Layer w0.203: v1(51.94,42.55) v1(50.8,41.4) 49.66,42.55 v1(49.53,42.55)
D-1: length 27.7
  Top Layer w0.203: U6.8 23.62,21.19 23.01,20.57 21.72,20.57 21.13,21.16 18.05,21.16 17.34,20.45 D4.6 D4.1 17.53,16.95 17.53,10.16 16.43,9.06 12.68,9.06 CN6.2
D-2: length 27.4
  Top Layer w0.203: CN3.2 30.71,9.06 34.69,9.06 35.81,10.19 35.81,15.68 35.37,16.13 D5.1 D5.6 35.37,20.45 36.08,21.16 38.79,21.16 39.2,20.74 40.68,20.74 41.15,21.21 U8.8
D-3: length 26.9
  Top Layer w0.203: CN4.2 48.74,9.06 52.97,9.06 54.1,10.19 54.1,15.68 53.66,16.13 D6.1 D6.6 53.66,20.45 54.34,21.13 54.96,21.13 55.31,20.78 58.24,20.78 58.93,21.46 U10.8
D-4: length 26.3
  Top Layer w0.203: CN5.2 66.78,9.06 71.29,9.06 71.88,9.65 71.88,16.95 D7.1 D7.6 71.69,21.81 70.81,22.69 70.81,23.68 70.04,24.45 U12.8
D-HUB1: length 21.2
  Top Layer w0.203: U6.6 24.62,20.69 24.8,20.51 25.81,20.51 30.45,25.15 41.07,25.15 41.27,25.35 41.27,26.08
D-HUB2: length 8.8
  Top Layer w0.203: U1.3 43.82,20.89 43.43,20.51 42.33,20.51 42.15,20.69 U8.6
D-HUB3: length 25.1
  Top Layer w0.203: U10.6 59.93,20.69 60.11,20.51 61.72,20.51 62.23,21.02 62.23,23.72 61.59,24.36 52.93,24.36 52.07,23.5 48.01,23.5 46.36,25.15 U1.5
D-HUB4: length 26.3
  Top Layer w0.203: U12.6 70.1,25.45 70.28,25.63 70.28,26.67 69.78,27.18 65.02,27.18 64.14,26.29 52.7,26.29 51.24,24.82 49.8,24.82 48.89,25.72 48.89,26.08
DATA-1: length 51.8
  Top Layer w0.254: v1(44.96,44.2) R22.2 ; U6.9 23.12,23.38 23.37,23.62 25.15,23.62 25.65,24.13 25.65,28.57 24.76,29.46 21.08,29.46 20.45,30.1 v1(20.45,32.51)
  Inner2 w0.254: v1(20.45,32.51) 20.45,30.23
  Bottom Layer w0.254: v1(44.96,44.2) 44.96,43.5 43.54,42.08 43.54,38.71 42.88,38.05 39.08,38.05 37.55,36.53 29.61,36.53 26.89,33.81 21.74,33.81 v1(20.45,32.51)
DATA-2: length 55.2
  Top Layer w0.254: v1(44.96,41.15) R23.2 ; U8.9 v1(40.65,23.75) ; U14.3 v1(22.99,32.51)
  Inner2 w0.254: v1(22.99,32.51) 25.17,30.33 36.99,30.33 38.11,29.21 40.13,29.21 40.64,28.7 40.64,23.76 v1(40.65,23.75)
  Bottom Layer w0.254: v1(44.96,41.15) 44.25,40.44 44.25,38.41 43.18,37.34 39.37,37.34 37.85,35.81 29.9,35.81 27.18,33.1 23.57,33.1 v1(22.99,32.51)
DATA-3: length 79.8
  Top Layer w0.254: R24.2 v1(44.96,48.77) ; v1(57.15,23.24) 57.43,23.52 58.17,23.52 58.43,23.27 U10.9 ; U14.5 v1(25.53,32.51)
  Inner1 w0.254: v1(44.96,48.77) 45.47,48.77 45.95,48.29 45.95,39.84 44.15,38.05 39.08,38.05 37.3,36.27 30.63,36.27 27.87,33.52 26.53,33.52 v1(25.53,32.51)
  Inner2 w0.254: v1(25.53,32.51) 27,31.04 37.29,31.04 38.4,29.92 40.08,29.92 41.2,31.04 56.97,31.04 57.79,30.23 57.79,23.88 v1(57.15,23.24)
DATA-4: length 88.4
  Top Layer w0.254: U12.9 69.27,23.95 69.6,23.62 69.6,22.73 v1(69.21,22.35) ; 28.07,30.79 v1(28.07,32.51) ; R25.2 v1(44.96,51.82)
  Inner1 w0.254: v1(44.96,51.82) 45.97,51.82 46.66,51.13 46.66,39.55 44.45,37.34 39.37,37.34 37.59,35.56 30.92,35.56 28.07,32.7 v1(28.07,32.51)
  Inner2 w0.254: v1(69.21,22.35) 69.21,23.83 64.62,28.42 64.62,30.53 63.39,31.75 28.83,31.75 v1(28.07,32.51)
INT-OUT: length 16.6
  Top Layer w0.254: R39.2 12.46,49.53 22.23,49.53 26.04,45.72 CN1.7
INTERRUPT: length 208.7
  Top Layer w0.254: R39.1 10.8,45.86 10.8,41.28 10.09,40.57 D2.6 ; 62.62,50.73 62.86,50.98 v1(62.86,51.82) ; U5.3 11.75,17.59 v1(12.19,18.03) ; 6.36,40.7 v1(6.36,41.33) 6.36,42.16 ; U7.3 29.78,17.59 v1(30.23,18.03) ; v1(66.67,18.03) 66.23,17.59 U11.3 ; v1(48.64,18.09) 48.2,17.64 U9.3
  Inner2 w0.254: 30.15,7.87 48.64,7.87 ; 30.15,7.87 13.46,7.87 12.19,9.14 v1(12.19,18.03) 12.19,19.18 1.4,29.97 1.4,41.02 2.54,42.16 4.32,42.16 5.15,41.33 v1(6.36,41.33) 7.3,41.33 11.43,45.47 11.43,48.51 12.7,49.78 22.1,49.78 23.62,51.31 44.64,51.31 44.72,51.23 45.2,51.23 45.28,51.31 50.04,51.31 51.18,52.45 62.23,52.45 v1(62.86,51.82) ; 30.15,7.87 30.23,7.95 v1(30.23,18.03) ; 48.64,7.87 48.64,7.88 v1(48.64,18.09) ; 48.64,7.87 65.53,7.87 66.67,9.02 v1(66.67,18.03)
LED1: length 43.5
  Top Layer w0.254: v1(35.43,34.16) 35.27,34.33 U13.14
  Inner1 w0.254: v1(35.43,34.16) 35.81,33.78 37.34,33.78 37.85,33.27 37.85,30.23 34.8,27.18 v1(32.77,27.18)
  Bottom Layer w0.254: v1(32.77,27.18) 24.38,27.18 19.05,21.84 19.05,17.78 16.94,15.67 11,15.67 LED1.1
LED2: length 39.4
  Top Layer w0.254: 37.21,30.66 38.15,29.72 42.16,29.72 42.93,28.96 v1(42.93,28.19)
  Inner2 w0.254: v1(42.93,28.19) 43.43,27.69 43.43,20.32 35.56,12.45 35.56,10.16 35.05,9.65 32.77,9.65 v1(31.75,10.67)
  Bottom Layer w0.254: v1(31.75,10.67) 31.75,12.95 LED2.1
LED3: length 48.7
  Top Layer w0.254: U13.5 33.96,32.7 v1(34.8,33.53)
  Inner1 w0.254: v1(25.73,23.06) 25.73,24.15 26.04,24.46 27,24.46 27.18,24.64 27.18,27.69 28.02,28.52 33.1,28.52 34.37,29.8 34.37,33.1 v1(34.8,33.53)
  Bottom Layer w0.254: LED3.1 38.61,15.75 37.34,17.02 37.34,21.08 37.08,21.34 26.16,21.34 25.73,21.77 v1(25.73,23.06)
LED4: length 52.5
  Top Layer w0.254: v1(35.05,32.77) 34.61,32.33 U13.6
  Inner1 w0.254: v1(32.77,27.94) 33.53,27.94 35.05,29.46 v1(35.05,32.77)
  Bottom Layer w0.254: v1(32.77,27.94) 38.35,27.94 39.37,26.92 59.18,26.92 59.94,26.16 59.94,15.75 60.38,15.31 64.84,15.31 LED4.1
ONEWIRE: length 39.2
  Top Layer w0.254: U2.4 v1(11.18,30.1) ; v1(6.86,37.72) 6.86,38.61 6.79,38.67 D2.4 v1(5.33,38.67)
  Inner1 w0.254: v1(5.33,38.67) 6.67,38.67 7.37,39.37 9.91,39.37 10.54,38.74 13.33,38.74 16.26,41.66 26,41.66 CN1.2
  Bottom Layer w0.254: v1(6.86,37.72) 8.38,37.72 11.18,34.93 v1(11.18,30.1)
POWER-1: length 65.3
  Top Layer w0.254: R21.2 v1(44.96,45.72) ; U14.15 v1(21.72,34.54) ; U5.4 13.46,17.47 v1(13.46,16.26)
  Inner1 w0.254: v1(16.26,29.64) 19.89,29.64 21.84,27.69 21.84,24.89 20.83,23.88 19.81,23.88 16.26,20.32 16.26,19.05 v1(13.46,16.26)
  Inner2 w0.254: v1(21.72,34.54) 20.07,34.54 16.26,30.73 v1(16.26,29.64)
  Bottom Layer w0.254: v1(44.96,45.72) 44.96,45.02 44.37,44.44 44.37,43.42 43.18,42.22 43.18,38.85 42.73,38.41 38.93,38.41 37.4,36.88 29.46,36.88 27.75,35.18 22.35,35.18 v1(21.72,34.54)
POWER-2: length 57.3
  Top Layer w0.254: U14.2 v1(21.72,32.51) ; U7.4 31.5,17.47 v1(31.5,16.26) ; R20.2 v1(44.96,42.67)
  Inner2 w0.254: v1(31.5,16.26) 31.5,28.45 29.97,29.97 24.26,29.97 v1(21.72,32.51)
  Bottom Layer w0.254: v1(21.72,32.51) 22.66,33.45 27.03,33.45 29.75,36.17 37.7,36.17 39.22,37.69 43.03,37.69 43.89,38.56 43.89,41.61 v1(44.96,42.67)
POWER-3: length 73.6
  Top Layer w0.254: v1(49.91,16.31) 49.91,17.52 U9.4 ; U14.4 v1(24.26,32.51) ; v1(44.96,47.24) R19.2
  Inner1 w0.254: v1(44.96,47.24) 45.59,46.61 45.59,39.99 44.01,38.41 38.93,38.41 37.15,36.63 30.48,36.63 27.73,33.87 25.62,33.87 v1(24.26,32.51)
  Inner2 w0.254: v1(49.91,16.31) 49.91,24.75 45.09,29.57 38.26,29.57 37.14,30.68 26.09,30.68 v1(24.26,32.51)
POWER-4: length 92.5
  Top Layer w0.254: v1(44.96,50.29) R18.2 ; v1(67.95,16.26) 67.95,17.47 U11.4 ; U14.6 v1(26.8,32.51)
  Inner1 w0.254: v1(44.96,50.29) 45.72,50.29 46.3,49.71 46.3,39.7 44.3,37.69 39.22,37.69 37.44,35.92 30.78,35.92 27.96,33.1 27.38,33.1 v1(26.8,32.51)
  Inner2 w0.254: v1(26.8,32.51) 27.92,31.39 63.25,31.39 64.26,30.38 64.26,28.28 67.95,24.59 v1(67.95,16.26)
VDS1: length 47.1
  Top Layer w0.254: U5.1 9.84,19.49 v1(9.4,19.05) 9.4,12.19 LED1.3 ; v1(18.29,20.57) D4.5 v1(18.29,18.29) ; C9.1 5.33,9.65 ; C11.1 v1(5.91,16.51)
  Top Layer w1.27: C11.1 C10.1 C9.1 5.91,8.07 CN6.1
  Bottom Layer w0.254: v1(9.4,19.05) 16.76,19.05 v1(18.29,20.57) ; v1(5.91,16.51) 6.67,17.27 17.27,17.27 v1(18.29,18.29)
VDS2: length 46.2
  Top Layer w0.254: LED2.3 27.43,12.19 v1(27.43,19.05) 27.87,19.49 U7.1 ; C16.1 v1(24.2,16.51) ; v1(36.32,18.29) D5.5 v1(36.32,20.57)
  Top Layer w1.27: CN3.1 24.2,7.82 C14.1 C15.1 C16.1
  Bottom Layer w0.254: v1(36.32,20.57) 34.8,19.05 v1(27.43,19.05) ; v1(36.32,18.29) 35.31,17.27 24.96,17.27 v1(24.2,16.51)
VDS3: length 46.1
  Top Layer w0.254: C21.1 v1(42.49,16.51) ; v1(54.61,20.57) D6.5 v1(54.61,18.29) ; LED3.3 45.72,12.19 v1(45.72,19.05) 46.16,19.49 47.36,19.49
  Top Layer w1.27: C21.1 C20.1 C19.1 42.49,7.57 CN4.1
  Bottom Layer w0.254: v1(42.49,16.51) 43.25,17.27 53.59,17.27 v1(54.61,18.29) ; v1(54.61,20.57) 53.09,19.05 v1(45.72,19.05)
VDS4: length 45.9
  Top Layer w0.254: v1(60.71,16.51) 60.71,14.92 C26.1 ; v1(72.64,18.29) D7.5 v1(72.64,20.57) ; LED4.3 63.75,12.19 v1(63.75,19.05) 64.2,19.49 65.4,19.49
  Top Layer w1.27: C26.1 C25.1 C24.1 60.52,7.57 CN5.1
  Bottom Layer w0.254: v1(72.64,20.57) 71.12,19.05 v1(63.75,19.05) ; v1(60.71,16.51) 61.47,17.27 71.63,17.27 v1(72.64,18.29)
VUSB: length 59.8
  Top Layer w0.254: D3.5 v1(50.29,37.85)
  Top Layer w0.508: U4.6 60.57,48.83 C7.2 58.51,48.99 v1(57.4,48.99) v1(57.4,50.04) v1(57.4,51.05) v1(56.77,51.69) ; v1(51.31,45.39) CN2.A4 CN2.B9 v1(56.26,45.39) ; v1(56.39,48.99) CN2.B4 CN2.A9 v1(51.31,48.99)
  Bottom Layer w0.508: 53.82,45.39 v1(51.31,45.39) 50.09,45.39 48.64,43.94 48.64,39.5 v1(50.29,37.85) 51.31,38.86 51.31,39.76 53.71,42.16 56.64,42.16 57.4,42.93 v1(57.4,48.99) v1(57.4,50.04) v1(57.4,51.05) v1(56.77,51.69) ; 53.82,45.39 v1(56.26,45.39) ; 53.82,45.39 53.86,45.44 53.86,48.99 ; 53.86,48.99 v1(56.39,48.99) ; 53.86,48.99 v1(51.31,48.99)
$1N390: length 5.3
  Top Layer w0.254: X1.1 42.4,36.18 41.4,35.18 41.4,33.53 42.55,32.39 U1.15
$1N404: length 2.8
  Top Layer w0.254: U1.14 43.82,33.72 C2.2
$1N405: length 3
  Top Layer w0.254: X1.3 40.89,33.84 40.89,33.48 41.27,33.1 41.27,31.83
$1N406: length 2.9
  Top Layer w0.254: U1.13 45.08,33.46 C1.2
$1N2303: length 10.7
  Top Layer w0.254: R7.2 R9.2 R8.2 ; R8.2 61.98,47.5 61.47,48.01 61.47,49.25 60.93,49.78 U4.5 ; R8.2 R10.2 R11.2
$2N997: length 3.3
  Top Layer w0.254: U5.5 13.09,18.54 12.45,19.19 12.45,20.58 R14.2
$2N2024: length 3.3
  Top Layer w0.254: R15.2 30.48,20.58 30.48,19.19 31.13,18.54 U7.5
$2N2374: length 3
  Top Layer w0.254: 49.4,21.13 48.9,20.64 48.9,19.24 49.55,18.59
$2N2724: length 3
  Top Layer w0.254: R17.2 66.93,20.58 66.93,19.19 67.58,18.54
$3N2300: length 2.4
  Top Layer w0.254: C32.2 35.92,28.99 U13.8
$6N811: length 5
  Top Layer w0.254: R29.2 14.52,13.21 LED1.2
$6N813: length 5
  Top Layer w0.254: R28.2 32.53,13.21 LED2.2
$6N815: length 5
  Top Layer w0.254: R27.2 50.82,13.21 LED3.2
$6N817: length 5
  Top Layer w0.254: R26.2 68.85,13.21 LED4.2

## Copper pours and planes (outline as drawn; the poured copper is in the pictures)
+5V on Top Layer: 56.39,40.39 58.04,40.39 58.04,38.74 56.39,38.74
+5V on Bottom Layer: 56.39,40.39 58.04,40.39 58.04,38.74 56.39,38.74
GND on Top Layer: -1.02,54.1 77.47,54.1 77.47,-0.76 -1.02,-0.76
GND on Bottom Layer: -1.52,54.36 77.22,54.36 77.22,-1.27 -1.52,-1.27
GND on Inner1: -1.02,53.85 77.72,53.85 77.72,-1.02 -1.02,-1.02
GND on Inner2: -0.76,54.86 77.22,54.86 77.22,-1.02 -0.76,-1.02

Small or netless copper shapes (teardrops, artwork), in the pictures only: 547 on Top Layer, 105 on Bottom Layer, 30 on Inner1, 51 on Inner2

## Text on the board
Bottom Silkscreen Layer: https://github.com/rit-construct-makerspace/access-control-hardware | USB Hub Smart Switch | Access Control System | Version 3.0.0, January 2026 | Jim Heaney, RIT SHED Makerspace | Open Source, Licensed CERN-OHL-S
Top Silkscreen Layer: INT | ACC | BYP | USB Hub | Switch | Smart | Version 3.0.0 | Jan 2026
